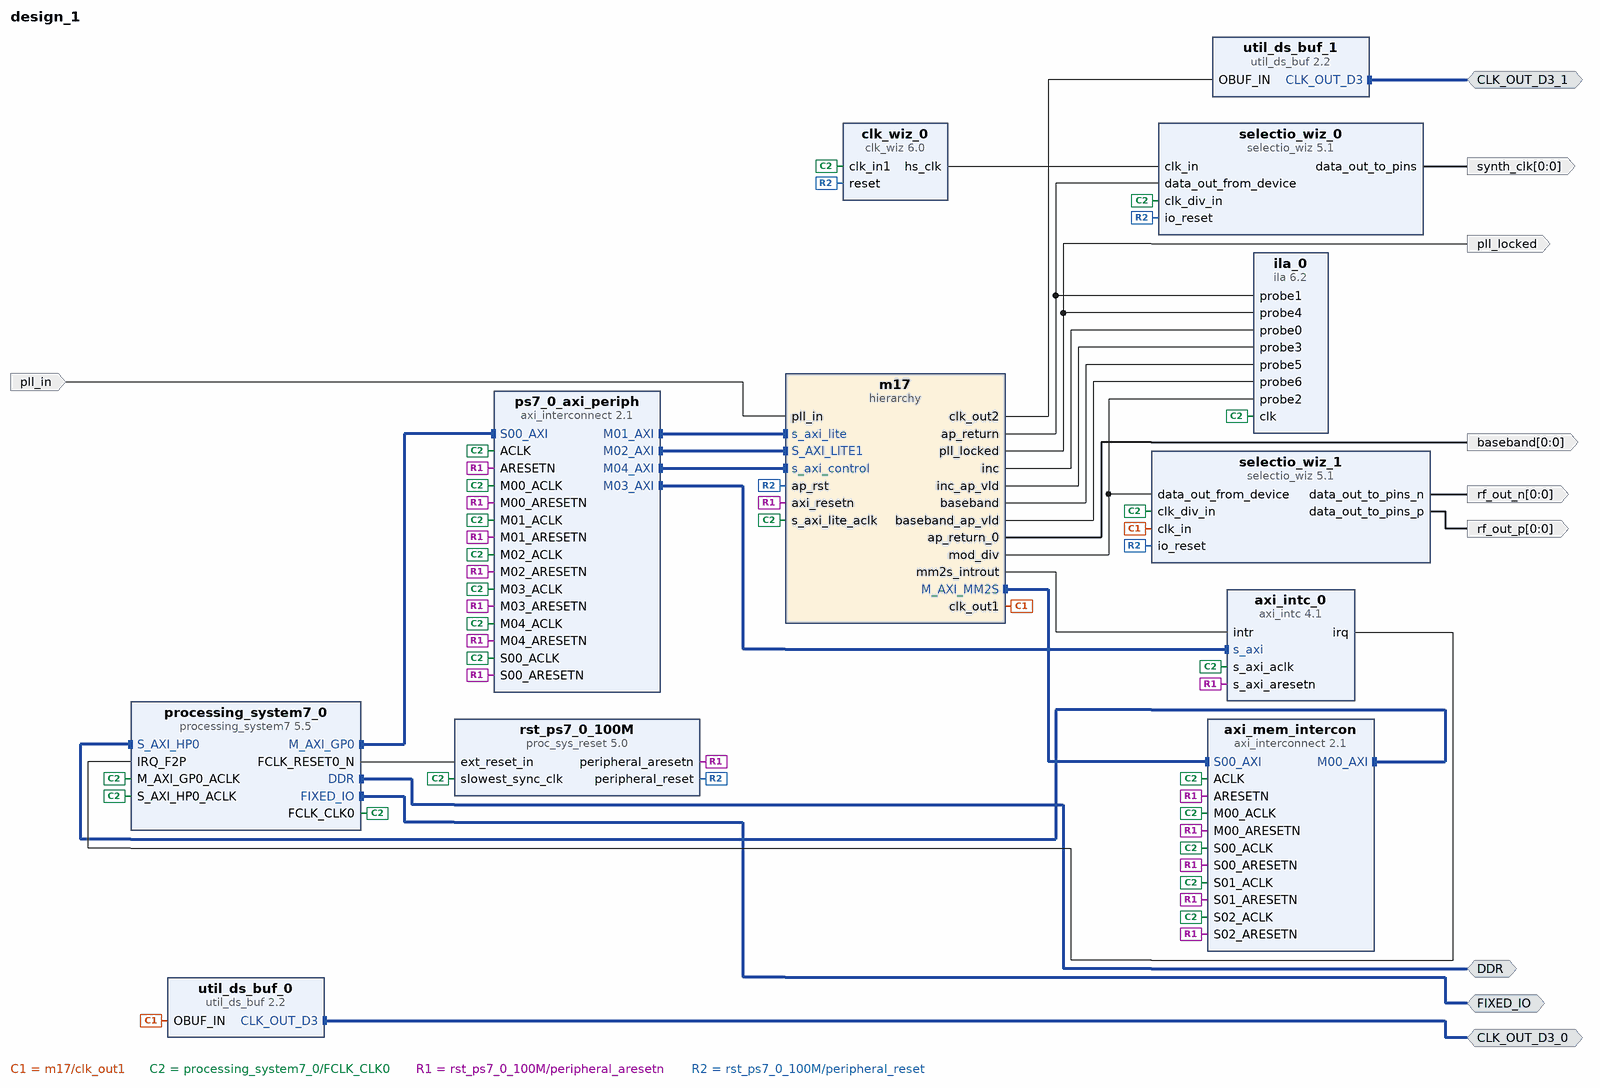
[diagram p0: block diagram of the top level]
# Vivado block design design_1, xc7z020clg400-1, Vivado 2021.1
create_bd_design design_1

create_bd_intf_port -mode Master -vlnv xilinx.com:interface:ddrx_rtl:1.0 DDR
create_bd_intf_port -mode Master -vlnv xilinx.com:display_processing_system7:fixedio_rtl:1.0 FIXED_IO
create_bd_intf_port -mode Master -vlnv xilinx.com:interface:diff_clock_rtl:1.0 CLK_OUT_D3_0
create_bd_intf_port -mode Master -vlnv xilinx.com:interface:diff_clock_rtl:1.0 CLK_OUT_D3_1
create_bd_port -dir O pll_locked
create_bd_port -dir O -from 0 -to 0 -type data synth_clk
create_bd_port -dir I -type clk pll_in
set_property -dict {CONFIG.FREQ_HZ 50000000} [get_bd_ports pll_in]
create_bd_port -dir O -from 0 -to 0 -type data rf_out_p
create_bd_port -dir O -from 0 -to 0 -type data rf_out_n
create_bd_port -dir O -from 0 -to 0 -type data baseband

create_bd_cell -type ip -vlnv xilinx.com:ip:processing_system7:5.5 processing_system7_0
set_property -dict [list \
  CONFIG.PCW_APU_PERIPHERAL_FREQMHZ 650 \
  CONFIG.PCW_CRYSTAL_PERIPHERAL_FREQMHZ 50 \
  CONFIG.PCW_ENET0_ENET0_IO {MIO 16 .. 27} \
  CONFIG.PCW_ENET0_GRP_MDIO_ENABLE 1 \
  CONFIG.PCW_ENET0_GRP_MDIO_IO {MIO 52 .. 53} \
  CONFIG.PCW_ENET0_PERIPHERAL_ENABLE 1 \
  CONFIG.PCW_ENET0_RESET_ENABLE 1 \
  CONFIG.PCW_ENET0_RESET_IO {MIO 9} \
  CONFIG.PCW_ENET_RESET_ENABLE 1 \
  CONFIG.PCW_ENET_RESET_SELECT {Share reset pin} \
  CONFIG.PCW_FPGA0_PERIPHERAL_FREQMHZ 100 \
  CONFIG.PCW_FPGA1_PERIPHERAL_FREQMHZ 50 \
  CONFIG.PCW_GPIO_MIO_GPIO_ENABLE 1 \
  CONFIG.PCW_GPIO_MIO_GPIO_IO MIO \
  CONFIG.PCW_I2C_RESET_ENABLE 1 \
  CONFIG.PCW_IRQ_F2P_INTR 1 \
  CONFIG.PCW_M_AXI_GP0_FREQMHZ 10 \
  CONFIG.PCW_PERIPHERAL_BOARD_PRESET part0 \
  CONFIG.PCW_PRESET_BANK1_VOLTAGE {LVCMOS 1.8V} \
  CONFIG.PCW_QSPI_GRP_FBCLK_ENABLE 1 \
  CONFIG.PCW_QSPI_GRP_FBCLK_IO {MIO 8} \
  CONFIG.PCW_QSPI_GRP_SINGLE_SS_ENABLE 1 \
  CONFIG.PCW_QSPI_GRP_SINGLE_SS_IO {MIO 1 .. 6} \
  CONFIG.PCW_QSPI_PERIPHERAL_ENABLE 1 \
  CONFIG.PCW_QSPI_QSPI_IO {MIO 1 .. 6} \
  CONFIG.PCW_SD0_GRP_CD_ENABLE 1 \
  CONFIG.PCW_SD0_GRP_CD_IO {MIO 47} \
  CONFIG.PCW_SD0_GRP_WP_ENABLE 0 \
  CONFIG.PCW_SD0_PERIPHERAL_ENABLE 1 \
  CONFIG.PCW_SD0_SD0_IO {MIO 40 .. 45} \
  CONFIG.PCW_SDIO_PERIPHERAL_FREQMHZ 50 \
  CONFIG.PCW_SINGLE_QSPI_DATA_MODE x4 \
  CONFIG.PCW_S_AXI_HP0_FREQMHZ 10 \
  CONFIG.PCW_UART0_PERIPHERAL_ENABLE 1 \
  CONFIG.PCW_UART0_UART0_IO {MIO 14 .. 15} \
  CONFIG.PCW_UART1_PERIPHERAL_ENABLE 0 \
  CONFIG.PCW_UART_PERIPHERAL_FREQMHZ 100 \
  CONFIG.PCW_UIPARAM_DDR_BUS_WIDTH {16 Bit} \
  CONFIG.PCW_UIPARAM_DDR_FREQ_MHZ 525 \
  CONFIG.PCW_UIPARAM_DDR_PARTNO {MT41J256M16 RE-125} \
  CONFIG.PCW_USB0_PERIPHERAL_ENABLE 1 \
  CONFIG.PCW_USB0_RESET_ENABLE 1 \
  CONFIG.PCW_USB0_RESET_IO {MIO 46} \
  CONFIG.PCW_USB0_USB0_IO {MIO 28 .. 39} \
  CONFIG.PCW_USB_RESET_ENABLE 1 \
  CONFIG.PCW_USB_RESET_SELECT {Share reset pin} \
  CONFIG.PCW_USE_FABRIC_INTERRUPT 1 \
  CONFIG.PCW_USE_S_AXI_HP0 1 \
] [get_bd_cells processing_system7_0]
# 495 more settings of processing_system7_0 are not shown: defaults, MIO pin electricals, DDR timing, and values the tool derives
create_bd_cell -type ip -vlnv xilinx.com:ip:proc_sys_reset:5.0 rst_ps7_0_100M
create_bd_cell -type ip -vlnv xilinx.com:ip:clk_wiz:6.0 clk_wiz_0
set_property -dict [list \
  CONFIG.CLKIN1_JITTER_PS 100.0 \
  CONFIG.CLKIN1_UI_JITTER 0.010 \
  CONFIG.CLKIN2_JITTER_PS 100.0 \
  CONFIG.CLKIN2_UI_JITTER 0.010 \
  CONFIG.CLKOUT1_DRIVES BUFG \
  CONFIG.CLKOUT1_JITTER 88.257 \
  CONFIG.CLKOUT1_PHASE_ERROR 264.947 \
  CONFIG.CLKOUT1_REQUESTED_OUT_FREQ 400.000 \
  CONFIG.CLKOUT2_DRIVES BUFG \
  CONFIG.CLKOUT2_JITTER 114.425 \
  CONFIG.CLKOUT2_PHASE_ERROR 264.947 \
  CONFIG.CLKOUT2_USED true \
  CONFIG.CLKOUT3_DRIVES BUFG \
  CONFIG.CLKOUT4_DRIVES BUFG \
  CONFIG.CLKOUT5_DRIVES BUFG \
  CONFIG.CLKOUT6_DRIVES BUFG \
  CONFIG.CLKOUT7_DRIVES BUFG \
  CONFIG.CLK_IN1_BOARD_INTERFACE Custom \
  CONFIG.CLK_OUT1_PORT hs_clk \
  CONFIG.CLK_OUT2_PORT fs_clk \
  CONFIG.FEEDBACK_SOURCE FDBK_AUTO \
  CONFIG.JITTER_OPTIONS UI \
  CONFIG.JITTER_SEL Max_I_Jitter \
  CONFIG.MMCM_BANDWIDTH LOW \
  CONFIG.MMCM_CLKFBOUT_MULT_F 12 \
  CONFIG.MMCM_CLKIN1_PERIOD 10.000 \
  CONFIG.MMCM_CLKIN2_PERIOD 10.000 \
  CONFIG.MMCM_CLKOUT0_DIVIDE_F 3 \
  CONFIG.MMCM_CLKOUT1_DIVIDE 12 \
  CONFIG.MMCM_COMPENSATION ZHOLD \
  CONFIG.MMCM_DIVCLK_DIVIDE 1 \
  CONFIG.MMCM_REF_JITTER2 0.010 \
  CONFIG.NUM_OUT_CLKS 2 \
  CONFIG.PRIMITIVE PLL \
  CONFIG.PRIM_IN_FREQ 100.000 \
  CONFIG.PRIM_SOURCE No_buffer \
  CONFIG.USE_BOARD_FLOW true \
  CONFIG.USE_LOCKED false \
] [get_bd_cells clk_wiz_0]
create_bd_cell -type ip -vlnv xilinx.com:ip:axi_interconnect:2.1 ps7_0_axi_periph
set_property -dict {CONFIG.NUM_MI 5} [get_bd_cells ps7_0_axi_periph]
create_bd_cell -type ip -vlnv xilinx.com:ip:selectio_wiz:5.1 selectio_wiz_0
set_property -dict [list \
  CONFIG.BUS_DIR OUTPUTS \
  CONFIG.BUS_IO_STD LVCMOS33 \
  CONFIG.BUS_SIG_TYPE SINGLE \
  CONFIG.CLK_FWD_IO_STD HSTL_I \
  CONFIG.CLK_FWD_SIG_TYPE SINGLE \
  CONFIG.SELIO_ACTIVE_EDGE DDR \
  CONFIG.SELIO_BUS_IN_DELAY NONE \
  CONFIG.SELIO_CLK_BUF MMCM \
  CONFIG.SELIO_CLK_IO_STD LVCMOS33 \
  CONFIG.SELIO_CLK_SIG_TYPE SINGLE \
  CONFIG.SELIO_INTERFACE_TYPE NETWORKING \
  CONFIG.SERIALIZATION_FACTOR 8 \
  CONFIG.SYSTEM_DATA_WIDTH 1 \
  CONFIG.USE_SERIALIZATION true \
] [get_bd_cells selectio_wiz_0]
create_bd_cell -type ip -vlnv xilinx.com:ip:selectio_wiz:5.1 selectio_wiz_1
set_property -dict [list \
  CONFIG.BUS_DIR OUTPUTS \
  CONFIG.BUS_IO_STD TMDS_33 \
  CONFIG.BUS_SIG_TYPE DIFF \
  CONFIG.CLK_FWD_IO_STD DIFF_HSTL_I \
  CONFIG.CLK_FWD_SIG_TYPE DIFF \
  CONFIG.SELIO_ACTIVE_EDGE DDR \
  CONFIG.SELIO_BUS_IN_DELAY NONE \
  CONFIG.SELIO_CLK_BUF MMCM \
  CONFIG.SELIO_CLK_IO_STD TMDS_33 \
  CONFIG.SELIO_CLK_SIG_TYPE DIFF \
  CONFIG.SELIO_INTERFACE_TYPE NETWORKING \
  CONFIG.SERIALIZATION_FACTOR 8 \
  CONFIG.SYSTEM_DATA_WIDTH 1 \
  CONFIG.USE_SERIALIZATION true \
] [get_bd_cells selectio_wiz_1]
create_bd_cell -type ip -vlnv xilinx.com:ip:util_ds_buf:2.2 util_ds_buf_0
set_property -dict {CONFIG.C_BUF_TYPE OBUFDS} [get_bd_cells util_ds_buf_0]
create_bd_cell -type ip -vlnv xilinx.com:ip:util_ds_buf:2.2 util_ds_buf_1
set_property -dict {CONFIG.C_BUF_TYPE OBUFDS} [get_bd_cells util_ds_buf_1]
create_bd_cell -type ip -vlnv xilinx.com:ip:axi_intc:4.1 axi_intc_0
set_property -dict {CONFIG.C_IRQ_CONNECTION 1} [get_bd_cells axi_intc_0]
create_bd_cell -type ip -vlnv xilinx.com:ip:axi_interconnect:2.1 axi_mem_intercon
set_property -dict {CONFIG.NUM_MI 1 CONFIG.NUM_SI 3} [get_bd_cells axi_mem_intercon]
create_bd_cell -type ip -vlnv xilinx.com:ip:ila:6.2 ila_0
set_property -dict [list \
  CONFIG.ALL_PROBE_SAME_MU_CNT 2 \
  CONFIG.C_ENABLE_ILA_AXI_MON false \
  CONFIG.C_EN_STRG_QUAL 1 \
  CONFIG.C_MONITOR_TYPE Native \
  CONFIG.C_NUM_OF_PROBES 7 \
  CONFIG.C_PROBE0_MU_CNT 2 \
  CONFIG.C_PROBE0_WIDTH 32 \
  CONFIG.C_PROBE1_MU_CNT 2 \
  CONFIG.C_PROBE1_WIDTH 8 \
  CONFIG.C_PROBE2_WIDTH 8 \
  CONFIG.C_PROBE5_WIDTH 16 \
] [get_bd_cells ila_0]
create_bd_cell -type hier m17

# ---- hierarchy /m17 ----
current_bd_instance /m17
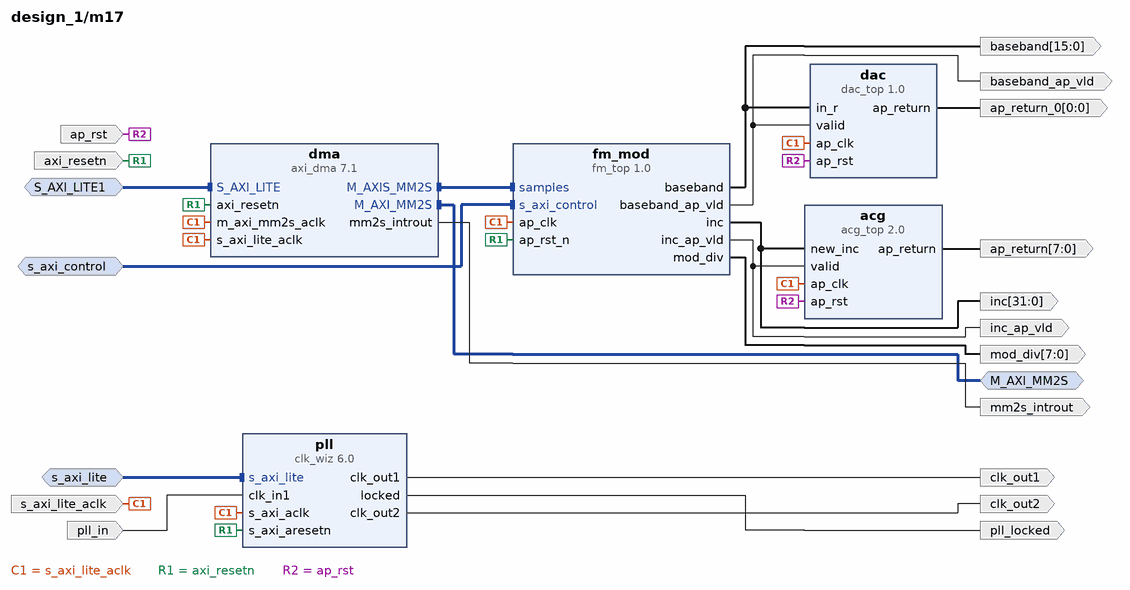
[diagram p1: block diagram inside /m17]
create_bd_intf_pin -mode Slave -vlnv xilinx.com:interface:aximm_rtl:1.0 s_axi_lite
create_bd_intf_pin -mode Slave -vlnv xilinx.com:interface:aximm_rtl:1.0 s_axi_control
create_bd_intf_pin -mode Slave -vlnv xilinx.com:interface:aximm_rtl:1.0 S_AXI_LITE1
create_bd_intf_pin -mode Master -vlnv xilinx.com:interface:aximm_rtl:1.0 M_AXI_MM2S
create_bd_pin -dir I -type clk s_axi_lite_aclk
create_bd_pin -dir I -type rst axi_resetn
create_bd_pin -dir I -type clk pll_in
create_bd_pin -dir O -type clk clk_out1
create_bd_pin -dir O -type clk clk_out2
create_bd_pin -dir O pll_locked
create_bd_pin -dir I -type rst ap_rst
create_bd_pin -dir O -from 7 -to 0 -type data ap_return
create_bd_pin -dir O -from 31 -to 0 -type data inc
create_bd_pin -dir O inc_ap_vld
create_bd_pin -dir O -from 7 -to 0 -type data mod_div
create_bd_pin -dir O -type intr mm2s_introut
create_bd_pin -dir O -from 0 -to 0 -type data ap_return_0
create_bd_pin -dir O -from 15 -to 0 -type data baseband
create_bd_pin -dir O baseband_ap_vld

create_bd_cell -type ip -vlnv xilinx.com:ip:clk_wiz:6.0 pll
set_property -dict [list \
  CONFIG.CLKIN1_JITTER_PS 125 \
  CONFIG.CLKIN1_UI_JITTER 1250.0 \
  CONFIG.CLKIN2_JITTER_PS 100.000 \
  CONFIG.CLKIN2_UI_JITTER 100.000 \
  CONFIG.CLKOUT1_DRIVES BUFG \
  CONFIG.CLKOUT1_JITTER 149.852 \
  CONFIG.CLKOUT1_PHASE_ERROR 470.575 \
  CONFIG.CLKOUT1_REQUESTED_OUT_FREQ 450 \
  CONFIG.CLKOUT2_DRIVES BUFH \
  CONFIG.CLKOUT2_JITTER 149.852 \
  CONFIG.CLKOUT2_PHASE_ERROR 470.575 \
  CONFIG.CLKOUT2_REQUESTED_OUT_FREQ 450 \
  CONFIG.CLKOUT2_REQUESTED_PHASE 90.000 \
  CONFIG.CLKOUT2_USED true \
  CONFIG.CLKOUT3_DRIVES BUFH \
  CONFIG.CLKOUT3_JITTER 180.959 \
  CONFIG.CLKOUT3_PHASE_ERROR 470.575 \
  CONFIG.CLKOUT3_REQUESTED_OUT_FREQ 112.5 \
  CONFIG.CLKOUT3_USED false \
  CONFIG.CLKOUT4_DRIVES BUFG \
  CONFIG.CLKOUT5_DRIVES BUFG \
  CONFIG.CLKOUT6_DRIVES BUFG \
  CONFIG.CLKOUT7_DRIVES BUFG \
  CONFIG.CLK_IN1_BOARD_INTERFACE Custom \
  CONFIG.FEEDBACK_SOURCE FDBK_AUTO \
  CONFIG.JITTER_OPTIONS PS \
  CONFIG.JITTER_SEL Max_I_Jitter \
  CONFIG.MMCM_BANDWIDTH LOW \
  CONFIG.MMCM_CLKFBOUT_MULT_F 18 \
  CONFIG.MMCM_CLKIN1_PERIOD 20.000 \
  CONFIG.MMCM_CLKIN2_PERIOD 10.0 \
  CONFIG.MMCM_CLKOUT0_DIVIDE_F 2 \
  CONFIG.MMCM_CLKOUT1_DIVIDE 2 \
  CONFIG.MMCM_CLKOUT1_PHASE 90.000 \
  CONFIG.MMCM_CLKOUT2_DIVIDE 1 \
  CONFIG.MMCM_COMPENSATION ZHOLD \
  CONFIG.MMCM_DIVCLK_DIVIDE 1 \
  CONFIG.MMCM_REF_JITTER1 0.062 \
  CONFIG.MMCM_REF_JITTER2 0.010 \
  CONFIG.NUM_OUT_CLKS 2 \
  CONFIG.OVERRIDE_MMCM false \
  CONFIG.PHASE_DUTY_CONFIG true \
  CONFIG.PRIMITIVE PLL \
  CONFIG.PRIM_IN_FREQ 50 \
  CONFIG.USE_BOARD_FLOW true \
  CONFIG.USE_DYN_RECONFIG true \
] [get_bd_cells pll]
create_bd_cell -type ip -vlnv Mobilinkd:acg:acg_top:2.0 acg
create_bd_cell -type ip -vlnv xilinx.com:ip:axi_dma:7.1 dma
set_property -dict [list \
  CONFIG.c_include_mm2s 1 \
  CONFIG.c_include_s2mm 0 \
  CONFIG.c_include_sg 0 \
  CONFIG.c_m_axis_mm2s_tdata_width 16 \
  CONFIG.c_micro_dma 0 \
] [get_bd_cells dma]
create_bd_cell -type ip -vlnv Mobilinkd:freq_mod:fm_top:1.0 fm_mod
create_bd_cell -type ip -vlnv Mobilinkd:dac:dac_top:1.0 dac

# ---- connections ----

current_bd_instance /m17
connect_bd_intf_net -intf_net axi_dma_0_M_AXIS_MM2S [get_bd_intf_pins fm_mod/samples] [get_bd_intf_pins dma/M_AXIS_MM2S]
connect_bd_intf_net -intf_net axi_dma_0_M_AXI_MM2S [get_bd_intf_pins M_AXI_MM2S] [get_bd_intf_pins dma/M_AXI_MM2S]
connect_bd_intf_net [get_bd_intf_pins s_axi_lite] [get_bd_intf_pins pll/s_axi_lite]
connect_bd_intf_net [get_bd_intf_pins S_AXI_LITE1] [get_bd_intf_pins dma/S_AXI_LITE]
connect_bd_intf_net [get_bd_intf_pins s_axi_control] [get_bd_intf_pins fm_mod/s_axi_control]
connect_bd_net -net acg_top_0_ap_return [get_bd_pins acg/ap_return] [get_bd_pins ap_return]
connect_bd_net -net axi_dma_0_mm2s_introut [get_bd_pins dma/mm2s_introut] [get_bd_pins mm2s_introut]
connect_bd_net -net clk_wiz_0_locked [get_bd_pins pll/locked] [get_bd_pins pll_locked]
connect_bd_net -net dac_top_0_ap_return [get_bd_pins dac/ap_return] [get_bd_pins ap_return_0]
connect_bd_net [get_bd_pins fm_mod/baseband] [get_bd_pins baseband] [get_bd_pins dac/in_r]
connect_bd_net [get_bd_pins fm_mod/baseband_ap_vld] [get_bd_pins baseband_ap_vld] [get_bd_pins dac/valid]
connect_bd_net -net fm_top_0_inc [get_bd_pins fm_mod/inc] [get_bd_pins inc] [get_bd_pins acg/new_inc]
connect_bd_net -net fm_top_0_inc_ap_vld [get_bd_pins fm_mod/inc_ap_vld] [get_bd_pins inc_ap_vld] [get_bd_pins acg/valid]
connect_bd_net -net fm_top_0_mod_div [get_bd_pins fm_mod/mod_div] [get_bd_pins mod_div]
connect_bd_net [get_bd_pins pll/clk_out1] [get_bd_pins clk_out1]
connect_bd_net [get_bd_pins pll/clk_out2] [get_bd_pins clk_out2]
connect_bd_net [get_bd_pins pll_in] [get_bd_pins pll/clk_in1]
connect_bd_net -net processing_system7_0_FCLK_CLK0 [get_bd_pins s_axi_lite_aclk] \
  [get_bd_pins dma/s_axi_lite_aclk] [get_bd_pins dma/m_axi_mm2s_aclk] [get_bd_pins acg/ap_clk] [get_bd_pins pll/s_axi_aclk] \
  [get_bd_pins fm_mod/ap_clk] [get_bd_pins dac/ap_clk]
connect_bd_net -net rst_ps7_0_100M_peripheral_aresetn [get_bd_pins axi_resetn] \
  [get_bd_pins dma/axi_resetn] [get_bd_pins pll/s_axi_aresetn] [get_bd_pins fm_mod/ap_rst_n]
connect_bd_net -net rst_ps7_0_100M_peripheral_reset [get_bd_pins ap_rst] [get_bd_pins acg/ap_rst] [get_bd_pins dac/ap_rst]

current_bd_instance /
connect_bd_intf_net -intf_net axi_dma_0_M_AXI_MM2S [get_bd_intf_pins m17/M_AXI_MM2S] [get_bd_intf_pins axi_mem_intercon/S00_AXI]
connect_bd_intf_net [get_bd_intf_pins axi_mem_intercon/M00_AXI] [get_bd_intf_pins processing_system7_0/S_AXI_HP0]
connect_bd_intf_net [get_bd_intf_ports DDR] [get_bd_intf_pins processing_system7_0/DDR]
connect_bd_intf_net [get_bd_intf_ports FIXED_IO] [get_bd_intf_pins processing_system7_0/FIXED_IO]
connect_bd_intf_net [get_bd_intf_pins processing_system7_0/M_AXI_GP0] [get_bd_intf_pins ps7_0_axi_periph/S00_AXI]
connect_bd_intf_net [get_bd_intf_pins ps7_0_axi_periph/M01_AXI] [get_bd_intf_pins m17/s_axi_lite]
connect_bd_intf_net [get_bd_intf_pins ps7_0_axi_periph/M02_AXI] [get_bd_intf_pins m17/S_AXI_LITE1]
connect_bd_intf_net [get_bd_intf_pins ps7_0_axi_periph/M03_AXI] [get_bd_intf_pins axi_intc_0/s_axi]
connect_bd_intf_net [get_bd_intf_pins ps7_0_axi_periph/M04_AXI] [get_bd_intf_pins m17/s_axi_control]
connect_bd_intf_net [get_bd_intf_ports CLK_OUT_D3_0] [get_bd_intf_pins util_ds_buf_0/CLK_OUT_D3]
connect_bd_intf_net [get_bd_intf_ports CLK_OUT_D3_1] [get_bd_intf_pins util_ds_buf_1/CLK_OUT_D3]
connect_bd_net -net acg_top_0_ap_return [get_bd_pins m17/ap_return] [get_bd_pins selectio_wiz_0/data_out_from_device] [get_bd_pins ila_0/probe1]
connect_bd_net -net axi_dma_0_mm2s_introut [get_bd_pins m17/mm2s_introut] [get_bd_pins axi_intc_0/intr]
connect_bd_net [get_bd_pins axi_intc_0/irq] [get_bd_pins processing_system7_0/IRQ_F2P]
connect_bd_net [get_bd_pins clk_wiz_0/hs_clk] [get_bd_pins selectio_wiz_0/clk_in]
connect_bd_net -net clk_wiz_0_locked [get_bd_pins m17/pll_locked] [get_bd_ports pll_locked] [get_bd_pins ila_0/probe4]
connect_bd_net -net fm_top_0_inc [get_bd_pins m17/inc] [get_bd_pins ila_0/probe0]
connect_bd_net -net fm_top_0_inc_ap_vld [get_bd_pins m17/inc_ap_vld] [get_bd_pins ila_0/probe3]
connect_bd_net -net fm_top_0_mod_div [get_bd_pins m17/mod_div] [get_bd_pins selectio_wiz_1/data_out_from_device] [get_bd_pins ila_0/probe2]
connect_bd_net [get_bd_pins m17/ap_return_0] [get_bd_ports baseband]
connect_bd_net [get_bd_pins m17/baseband] [get_bd_pins ila_0/probe5]
connect_bd_net [get_bd_pins m17/baseband_ap_vld] [get_bd_pins ila_0/probe6]
connect_bd_net -net pll_clk_out1 [get_bd_pins m17/clk_out1] [get_bd_pins util_ds_buf_0/OBUF_IN] [get_bd_pins selectio_wiz_1/clk_in]
connect_bd_net -net pll_clk_out2 [get_bd_pins m17/clk_out2] [get_bd_pins util_ds_buf_1/OBUF_IN]
connect_bd_net [get_bd_ports pll_in] [get_bd_pins m17/pll_in]
connect_bd_net [get_bd_pins processing_system7_0/FCLK_CLK0] \
  [get_bd_pins processing_system7_0/M_AXI_GP0_ACLK] [get_bd_pins rst_ps7_0_100M/slowest_sync_clk] \
  [get_bd_pins clk_wiz_0/clk_in1] [get_bd_pins ps7_0_axi_periph/ACLK] [get_bd_pins ps7_0_axi_periph/S00_ACLK] \
  [get_bd_pins ps7_0_axi_periph/M00_ACLK] [get_bd_pins ps7_0_axi_periph/M01_ACLK] [get_bd_pins selectio_wiz_0/clk_div_in] \
  [get_bd_pins selectio_wiz_1/clk_div_in] [get_bd_pins ps7_0_axi_periph/M02_ACLK] [get_bd_pins axi_intc_0/s_axi_aclk] \
  [get_bd_pins ps7_0_axi_periph/M03_ACLK] [get_bd_pins ps7_0_axi_periph/M04_ACLK] [get_bd_pins axi_mem_intercon/S00_ACLK] \
  [get_bd_pins processing_system7_0/S_AXI_HP0_ACLK] [get_bd_pins axi_mem_intercon/M00_ACLK] \
  [get_bd_pins axi_mem_intercon/ACLK] [get_bd_pins axi_mem_intercon/S01_ACLK] [get_bd_pins axi_mem_intercon/S02_ACLK] \
  [get_bd_pins ila_0/clk] [get_bd_pins m17/s_axi_lite_aclk]
connect_bd_net [get_bd_pins processing_system7_0/FCLK_RESET0_N] [get_bd_pins rst_ps7_0_100M/ext_reset_in]
connect_bd_net [get_bd_pins rst_ps7_0_100M/peripheral_aresetn] \
  [get_bd_pins ps7_0_axi_periph/ARESETN] [get_bd_pins ps7_0_axi_periph/S00_ARESETN] \
  [get_bd_pins ps7_0_axi_periph/M00_ARESETN] [get_bd_pins ps7_0_axi_periph/M01_ARESETN] \
  [get_bd_pins ps7_0_axi_periph/M02_ARESETN] [get_bd_pins axi_intc_0/s_axi_aresetn] \
  [get_bd_pins ps7_0_axi_periph/M03_ARESETN] [get_bd_pins ps7_0_axi_periph/M04_ARESETN] \
  [get_bd_pins axi_mem_intercon/S00_ARESETN] [get_bd_pins axi_mem_intercon/M00_ARESETN] \
  [get_bd_pins axi_mem_intercon/ARESETN] [get_bd_pins axi_mem_intercon/S01_ARESETN] \
  [get_bd_pins axi_mem_intercon/S02_ARESETN] [get_bd_pins m17/axi_resetn]
connect_bd_net [get_bd_pins rst_ps7_0_100M/peripheral_reset] \
  [get_bd_pins clk_wiz_0/reset] [get_bd_pins selectio_wiz_0/io_reset] [get_bd_pins selectio_wiz_1/io_reset] \
  [get_bd_pins m17/ap_rst]
connect_bd_net [get_bd_pins selectio_wiz_0/data_out_to_pins] [get_bd_ports synth_clk]
connect_bd_net [get_bd_pins selectio_wiz_1/data_out_to_pins_n] [get_bd_ports rf_out_n]
connect_bd_net [get_bd_pins selectio_wiz_1/data_out_to_pins_p] [get_bd_ports rf_out_p]

# ---- address map ----
assign_bd_address -offset 0x00000000 -range 512M -target_address_space [get_bd_addr_spaces m17/dma/Data_MM2S] [get_bd_addr_segs processing_system7_0/S_AXI_HP0/HP0_DDR_LOWOCM]
assign_bd_address -offset 0x40010000 -range 64K -target_address_space [get_bd_addr_spaces processing_system7_0/Data] [get_bd_addr_segs m17/fm_mod/s_axi_control/Reg]
assign_bd_address -offset 0x41200000 -range 64K -target_address_space [get_bd_addr_spaces processing_system7_0/Data] [get_bd_addr_segs axi_intc_0/S_AXI/Reg]
assign_bd_address -offset 0x41E00000 -range 64K -target_address_space [get_bd_addr_spaces processing_system7_0/Data] [get_bd_addr_segs m17/dma/S_AXI_LITE/Reg]
assign_bd_address -offset 0x43C10000 -range 64K -target_address_space [get_bd_addr_spaces processing_system7_0/Data] [get_bd_addr_segs m17/pll/s_axi_lite/Reg]

validate_bd_design
save_bd_design
